# Altium project AccelerometerChip.PrjPcb
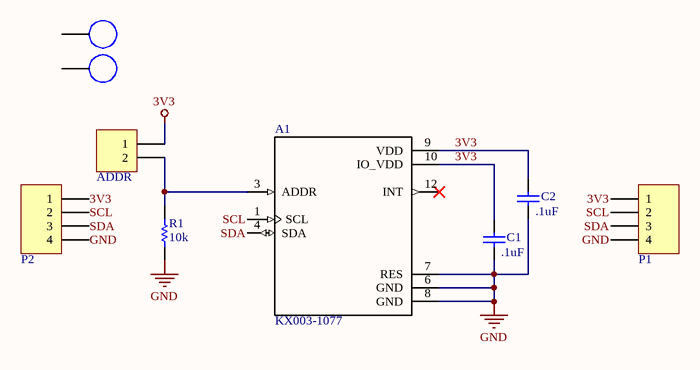
[diagram p0: AccelerometerSchematic.SchDoc]
1 sheet, 9 parts. Net scope: global (net labels, ports and power ports of the same name join across sheets).
Board file: AccelerometerLayout.PcbDoc

## Sheet AccelerometerSchematic.SchDoc
size A

### Parts
A1  KX003-1077  [*XDCR_KX003-1077]
ADDR  90120-0122  [HDR1X2]  (value not drawn)
C1  .1uF  [0805]
C2  .1uF  [0805]
DR1  4-40 DRILL HOLE  [4_40 DRILL HOLE]  (value not drawn)  (no BOM)
DR2  4-40 DRILL HOLE  [4_40 DRILL HOLE]  (value not drawn)  (no BOM)
P1  90120-0124  [HDR1X4]  (value not drawn)
P2  90120-0124  [HDR1X4]  (value not drawn)
R1  10k  [0805_RES_HD]

### Nets
3V3: A1.9(VDD) A1.10(IO_VDD) ADDR.1 C1.2 C2.2 P1.1 P2.1
GND: A1.6(GND) A1.7(RES) A1.8(GND) C1.1 C2.1 P1.4 P2.4 R1.1
SCL: A1.1(SCL) P1.2 P2.2
SDA: A1.4(SDA) P1.3 P2.3
NetA1_3: A1.3(ADDR) ADDR.2 R1.2

Not connected (* = marked no-connect by the designer): A1 12(INT)*; DR1 0; DR2 0

### Library data of the parts
A1 = KX003-1077: / Accelerometer X, Y, Z Axis Â±2g, 4g, 8g, 16g 3.5kHz _X,Y_, 1.8kHz _Z_ 12-LGA _2x2_ /; MF: Rohm Semiconductor; Digi-Key_Part_Number: KX003-1077CT-ND; Package: VFLGA-12 Rohm Semiconductor; SnapEDA_Link: https://www.snapeda.com/parts/KX003-1077/Rohm/view-part/3603894/?ref=snap; Digi-Key_Purchase_URL: https://www.digikey.com/product-detail/en/rohm-semiconductor/KX003-1077/KX003-1077CT-ND/9679234?utm_source=snapeda&utm_medium=aggregator&utm_campaign=symbol; MP: KX003-1077; Value: *
ADDR = 90120-0122: MOLEX CONN HEADER 2POS .100" STR TIN; GFUPartNo: 90120-0122; Manufacturer 1: Molex; Manufacturer Part Number 1: 90120-0122; Part Type: THRU; Supplier 1: Digi-Key; Supplier Part Number 1: WM8072-ND
C1 C2 = CL21A475KPFNNNE: .1, 10%, 50V; Manufacturer 1: Samsung; GFUPartNo: CL21A475KPFNNNE; Manufacturer Part Number 1: CL21A475KPFNNNE; Part Type: SMT; PackageReference: 0805; Supplier 1: Digi-Key; Supplier Part Number 1: 1276-1259-1-ND
DR1 DR2 = 4_40 DRILL HOLE: Mounting hole for 4-40 screw, non-BOM; GFUPartNo: 4_40 DRILL HOLE; Manufacturer 1: N/A; Manufacturer Part Number 1: N/A
P1 P2 = 90120-0124: CONN HEADER 4POS .100" STR TIN; Manufacturer 1: Molex; GFUPartNo: 90120-0124; Manufacturer Part Number 1: 90120-0124; Part Type: THRU; Supplier 1: Digi-Key; Supplier Part Number 1: WM8074-ND
R1 = RC2012F752CS: RES 10K OHM 1/8W 5% 0805; Manufacturer 1: Samsung; GFUPartNo: RC2012F752CS; Manufacturer Part Number 1: RC2012F752CS; Part Type: SMT; Supplier 1: Digi-Key; Supplier Part Number 1: 1276-5324-1-ND